# EasyEDA Pro project ProProject_AmaizeTrack.epro, board AmaizePCB
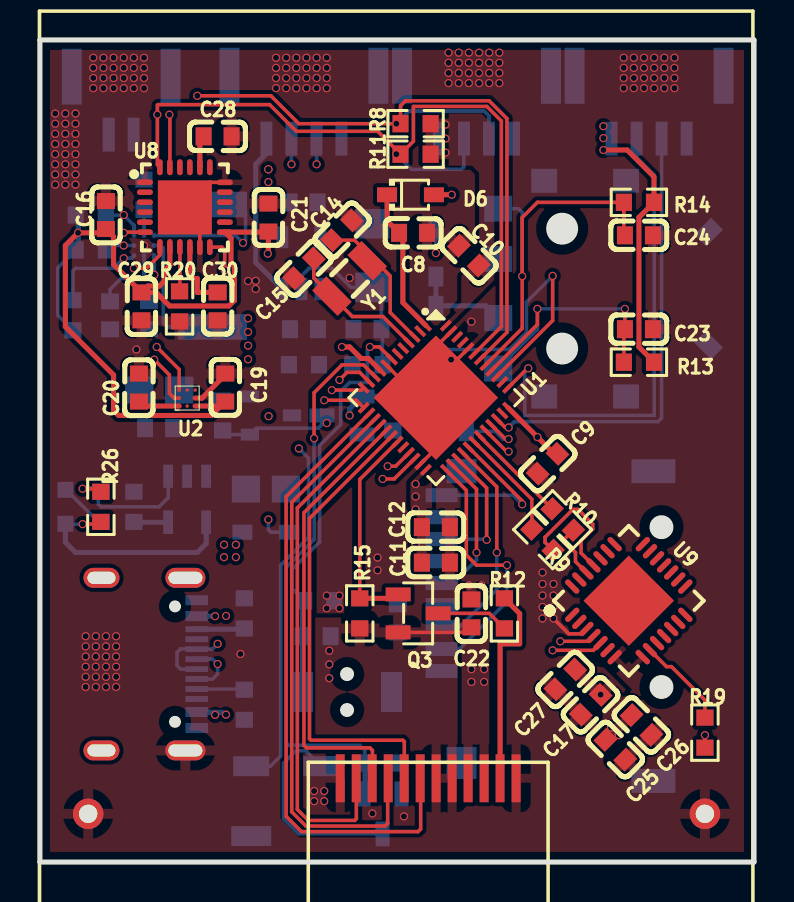
[diagram p2: board, top side]
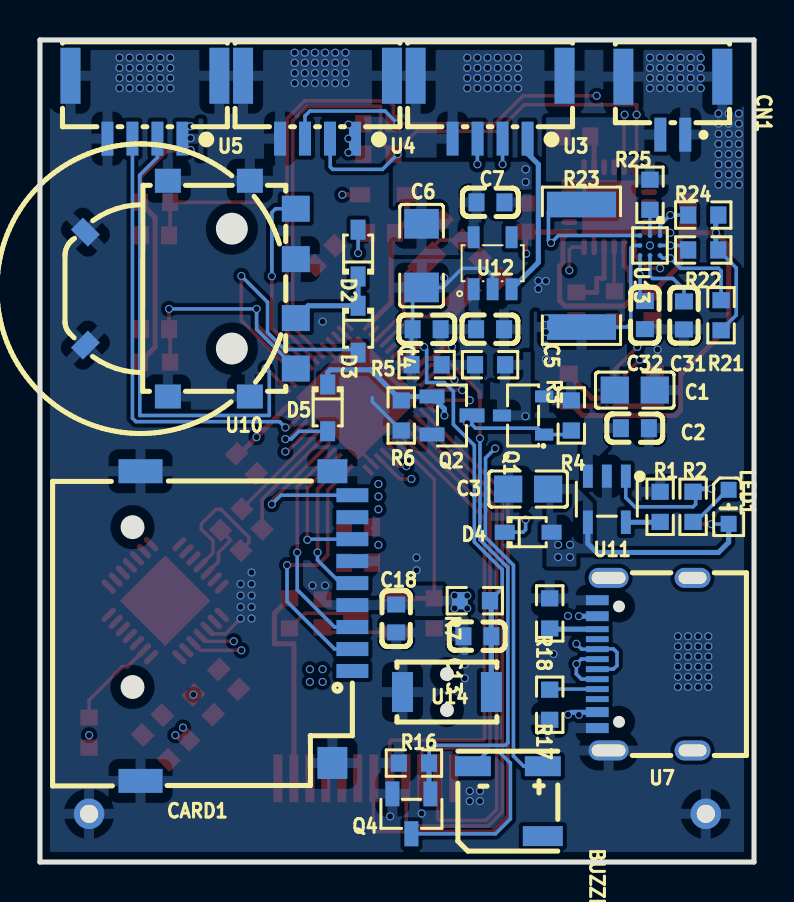
[diagram p3: board, bottom side, seen from below]

Outline 35.73 x 41.15 mm; copper layers: Top Layer, Inner1, Inner2, Bottom Layer. Coordinates in mm from the lower left corner of the outline.
Outline path: 0,41.15 35.73,41.15 35.73,0 0,0 0,41.15
Stack: Top Layer 0.035mm 外层铜厚1oz / Dielectric1 0.2104mm 7628 RC49% 8.6mil / Inner1 0.0152mm 内层铜厚 / Dielectric2 1.065mm 1.1mm H/HOZ 含铜 / Inner2 0.0152mm 内层铜厚 / Dielectric3 0.2104mm 7628 RC49% 8.6mil / Bottom Layer 0.035mm 外层铜厚1oz

## Design rules (mm)
template: 自定义配置
spacing copperThickness1oz (default): track to track 0.102, other pairs 0.152 to 0.3
spacing copperThickness2oz: track to track 0.203, other pairs 0.152 to 0.3
spacing copperThicknessInner0.5oz: track to track 0.089, other pairs 0.152 to 0.3
track width copperThickness1oz (default): min 0.102, default 0.254, max 2.54
track width copperThickness2oz: min 0.203, default 0.254, max 2.54
track width copperThickness0.5oz: min 0.089, default 0.254, max 2.54
differential pair differentialPair (default): width min 0.127, default 0.254, max 2.54; gap min 0.152, default 0.152
via viaSize (default): diameter min 0.3, default 0.61, max 10; hole min 0.201, default 0.305, max 6.299
net GND uses copperRegion1
net 3V3 uses copperRegion1
net BAT_IN uses copperRegion1
net BAT uses copperRegion1
net USB_VCC uses copperRegion1
net V33_CP2102 uses copperRegion1
net BAT_PACK+ uses copperRegion1

## Placement (name value [footprint] x y rotation side)
BUZZER1  4kHz  [BUZ-SMD_FST-5030]  12.32 3.05 0 bottom
C1  4.7uF  [C0805]  5.97 23.62 180 bottom
C2  100nF  [C0603]  5.96 21.72 180 bottom
C3  4.7uF  [C0805]  11.3 18.67 0 bottom
C4  100nF  [C0603]  16.38 26.67 0 bottom
C5  10uF  [C0603]  13.21 26.67 180 bottom
C6  22uF  [C1206]  16.64 30.35 270 bottom
C7  100nF  [C0603]  13.19 33.02 180 bottom
C8  100nF  [C0603]  18.67 31.5 180 top
C9  1uF  [C0603]  25.4 19.94 225 top
C10  1uF  [C0603]  21.46 30.35 135 top
C11  1uF  [C0603]  19.81 14.99 0 top
C12  1uF  [C0603]  19.81 16.76 0 top
C13  100nF  [C0603]  13.84 11.3 180 bottom
C14  22pF  [C0603]  15.11 31.62 225 top
C15  22pF  [C0603]  13.21 29.72 225 top
C16  1uF  [C0603]  3.3 32.39 270 top
C17  4.7uF  [C0603]  27.56 7.87 45 top
C18  100nF  [C0603]  17.91 12.19 90 bottom
C19  2.2uF  [C0603]  9.27 23.75 270 top
C20  4.7uF  [C0603]  4.95 23.75 90 top
C21  100nF  [C0603]  11.43 32.26 270 top
C22  100nF  [C0603]  21.59 12.45 90 top
C23  100nF  [C0603]  29.97 26.67 0 top
C24  100nF  [C0603]  29.97 31.37 0 top
C25  1uF  [C0603]  28.79 5.62 315 top
C26  100nF  [C0603]  30.1 6.86 315 top
C27  100nF  [C0603]  26.29 9.14 45 top
C28  2.2nF  [C0603]  8.89 36.32 0 top
C29  10nF  [C0603]  5.08 27.81 90 top
C30  100nF  [C0603]  8.89 27.81 270 top
C31  2.2uF  [C0603]  3.51 27.36 270 bottom
C32  1uF  [C0603]  5.46 27.38 90 bottom
CARD1  TF PUSH  [tf-smd_tf-push]  25.4 11.81 270 bottom
CN1  WAFER-GH1.25-2PWB  [CONN-TH_2P-P1.25_XUNPU_WAFER-GH1.25-2PWB]  4.06 37.86 0 bottom
D2  1N4148WS  [SOD-323_L1.8-W1.3-LS2.5-RD]  19.81 30.48 90 bottom
D3  1N4148WS  [SOD-323_L1.8-W1.3-LS2.5-RD]  19.81 26.67 270 bottom
D4  1N4148WS  [SOD-323_L1.8-W1.3-LS2.5-RD]  11.3 16.51 180 bottom
D5  1N4148WS  [SOD-323_L1.8-W1.3-LS2.5-RD]  21.34 22.73 270 bottom
D6  1N4007WS  [SOD-323_L1.8-W1.3-LS2.5-RD]  18.54 33.4 0 top
LCD1  SCREEN 2.0'  [SCREEN 2.0' 12PIN]  19.43 2.99 0 top
LED1  SZYY0603R  [LED0603-R-RD]  1.27 17.78 270 bottom
NOREF  -  [Pad_e649]  33.27 2.41 0 top
NOREF#2  -  [Pad_e650]  2.41 2.41 0 top
Q1  AO3401  [SOT-23-3_L2.9-W1.4-P1.90-LS2.6-BR]  11.56 22.35 180 bottom
Q2  AO3400  [SOT-23-3_L2.9-W1.3-P1.90-LS2.4-BR]  15.11 22.35 0 bottom
Q3  AO3400  [SOT-23-3_L2.9-W1.3-P1.90-LS2.4-BR]  18.92 12.45 180 top
Q4  AO3400  [SOT-23-3_L2.9-W1.3-P1.90-LS2.4-BR]  17.15 2.41 90 bottom
R1  2kΩ  [R0603]  4.7 17.78 90 bottom
R2  1kΩ  [R0603]  3.05 17.78 90 bottom
R3  20kΩ  [R0603]  13.21 24.89 0 bottom
R4  20kΩ  [R0603]  9.14 22.35 270 bottom
R5  20kΩ  [R0603]  16.38 24.89 0 bottom
R6  20kΩ  [R0603]  17.65 22.35 90 bottom
R7  10kΩ  [R0603]  13.97 13.08 180 bottom
R8  10kΩ  [R0603]  18.8 36.96 180 top
R9  100Ω  [R0603]  25.15 16.13 315 top
R10  100Ω  [R0603]  26.16 17.14 315 top
R11  10kΩ  [R0603]  18.8 35.43 180 top
R12  10Ω  [R0603]  23.24 12.45 270 top
R13  10kΩ  [R0603]  29.97 25.02 180 top
R14  10kΩ  [R0603]  29.97 33.02 180 top
R15  10kΩ  [R0603]  16 12.45 270 top
R16  10kΩ  [R0603]  17.02 4.95 0 bottom
R17  5.1kΩ  [R0603]  10.22 7.87 90 bottom
R18  5.1kΩ  [R0603]  10.22 12.45 270 bottom
R19  10kΩ  [R0603]  33.27 6.48 270 top
R20  10kΩ  [R0603]  6.99 27.81 90 top
R21  10kΩ  [R0603]  1.65 27.37 90 bottom
R22  10kΩ  [R0603]  2.54 30.64 0 bottom
R23  0Ω  [R2512]  8.64 29.84 270 bottom
R24  10kΩ  [R0603]  2.54 32.39 180 bottom
R25  SDNT1608X103F3380FTF  [R0603]  5.21 33.4 90 bottom
R26  10kΩ  [R0603]  3.05 17.78 90 top
U1  AT32F403ACGU7  [qfn-48_l6.0-w6.0-p0.40-bl-ep4.2]  19.81 23.24 225 top
U2  QMC6310U  [LGA-8_L1.2-W1.2-P0.40-R3-C3-TL]  7.37 23.22 180 top
U3  WAFER-GH1.25-4PWB  [CONN-SMD_4P-P1.25_XUNPU_WAFER-GH1.25-4PWB]  13.21 37.78 0 bottom
U4  WAFER-GH1.25-4PWB  [CONN-SMD_4P-P1.25_XUNPU_WAFER-GH1.25-4PWB]  21.84 37.78 0 bottom
U5  WAFER-GH1.25-4PWB  [CONN-SMD_4P-P1.25_XUNPU_WAFER-GH1.25-4PWB]  30.48 37.78 0 bottom
U7  USB-TYPE-C-019  [TYPE-C-SMD_HX-TYPE-C-16PIN]  5.46 9.91 90 bottom
U8  MPU-6050  [QFN-24_L4.0-W4.0-P0.50-BL-EP2.7]  7.25 32.78 270 top
U9  CP2102-GMR  [WQFN-28_L5.0-W5.0-P0.50-BL-EP3.2]  29.46 13.08 315 top
U10  SIQ-02FVS3  [SW-SMD_SIQ-02FVS3_1]  28.19 28.7 90 bottom
U11  MCP73831T-2ACI/OT  [SOT-23-5_L3.0-W1.7-P0.95-LS2.8-BL]  7.37 18.16 0 bottom
U12  LP5907MFX-3.3/NOPB  [SOT-23-5_L3.0-W1.7-P0.95-LS2.8-BR]  13.08 29.97 270 bottom
U13  BQ27220YZFR  [dsbga-9_l1.7-w1.6-r3-c3-p0.50-bl]  5.21 30.86 0 bottom
U14  ZX-QC34-2TPDZ  [KEY-SMD_L3.9-W3.0-LS5.0-EH]  15.37 8.51 180 bottom
Y1  32.768kHz  [FC-135R_L3.2-W1.5]  15.49 29.21 225 top

## Footprints (pads in the part's own frame, mm; a bottom-side part is the same pattern mirrored in y, then rotated)
BUZ-SMD_FST-5030
  rect 1.8x1 smd: 1(-1.75,-1.75) 2(1.75,-1.75)
  rect 2x1 smd: 3(-1.75,1.75)
C0603
  rect 0.8x0.9 smd: 1(-0.7,0) 2(0.7,0)
C0805
  rect 1.41x1.35 smd: 1(-1,0) 2(1,0)
C1206
  rect 1.485x1.728 smd: 1(-1.593,0) 2(1.593,0)
CONN-SMD_4P-P1.25_XUNPU_WAFER-GH1.25-4PWB
  rect 0.6x1.7 smd: 1(1.875,1.575) 2(0.625,1.575) 3(-0.625,1.575) 4(-1.875,1.575)
  rect 1x2.8 smd: 5(3.725,-1.575) 6(-3.725,-1.575)
CONN-TH_2P-P1.25_XUNPU_WAFER-GH1.25-2PWB
  rect 0.6x1.7 smd: 1(-0.625,1.45) 2(0.625,1.45)
  rect 1x2.8 smd: 3(-2.475,-1.45) 4(2.475,-1.45)
dsbga-9_l1.7-w1.6-r3-c3-p0.50-bl
  round 0.24 smd: A1(-0.5,-0.5) A2(-0.5,0) A3(-0.5,0.5) B1(0,-0.5) B2(0,0) B3(0,0.5) C1(0.5,-0.5) C2(0.5,0) C3(0.5,0.5)
FC-135R_L3.2-W1.5
  rect 1x1.8 smd: 1(-1.25,0) 2(1.25,0)
KEY-SMD_L3.9-W3.0-LS5.0-EH
  rect 1.05x2 smd: 1(-2.225,0) 2(2.225,0)
LED0603-R-RD
  rect 0.8x0.8 smd: 1(0.851,0) 2(-0.851,0)
LGA-8_L1.2-W1.2-P0.40-R3-C3-TL
  round 0.17 smd: A1(-0.4,0.4) A2(0,0.4) A3(0.4,0.4) B1(-0.4,0) B3(0.4,0) C1(-0.4,-0.4) C2(0,-0.4) C3(0.4,-0.4)
Pad_e649
  round 1.524 hole 0.914: 50(0,0)
Pad_e650
  round 1.524 hole 0.914: 51(0,0)
QFN-24_L4.0-W4.0-P0.50-BL-EP2.7
  oval 0.28x0.8 smd: 1(-1.25,-2) 2(-0.75,-2) 3(-0.25,-2) 4(0.25,-2) 5(0.75,-2) 6(1.25,-2) 13(1.25,2) 14(0.75,2) 15(0.25,2) 16(-0.25,2) 17(-0.75,2) 18(-1.242,2)
  oval 0.8x0.28 smd: 7(2,-1.25) 8(2,-0.75) 9(2,-0.25) 10(2,0.25) 11(2,0.75) 12(2,1.25) 19(-2,1.25) 20(-2,0.75) 21(-2,0.25) 22(-2,-0.25) 23(-2,-0.75) 24(-2,-1.25)
  rect 2.7x2.7 smd: 25(0.013,0)
qfn-48_l6.0-w6.0-p0.40-bl-ep4.2
  rect 0.2x0.665 smd: 1(-2.2,-2.908) 2(-1.8,-2.908) 3(-1.4,-2.907) 4(-1,-2.908) 5(-0.6,-2.908) 6(-0.2,-2.908) 7(0.2,-2.908) 8(0.6,-2.908) 9(1,-2.908) 10(1.4,-2.907) 11(1.8,-2.908) 12(2.2,-2.908) 25(2.2,2.908) 26(1.8,2.908) 27(1.4,2.907) 28(1,2.908) 29(0.6,2.908) 30(0.2,2.908) 31(-0.2,2.908) 32(-0.6,2.908) 33(-1,2.908) 34(-1.4,2.907) 35(-1.8,2.908) 36(-2.2,2.908)
  rect 0.665x0.2 smd: 13(2.908,-2.2) 14(2.908,-1.8) 15(2.907,-1.4) 16(2.908,-1) 17(2.908,-0.6) 18(2.908,-0.2) 19(2.908,0.2) 20(2.908,0.6) 21(2.908,1) 22(2.907,1.4) 23(2.908,1.8) 24(2.908,2.2) 37(-2.908,2.2) 38(-2.908,1.8) 39(-2.907,1.4) 40(-2.908,1) 41(-2.908,0.6) 42(-2.908,0.2) 43(-2.908,-0.2) 44(-2.908,-0.6) 45(-2.908,-1) 46(-2.907,-1.4) 47(-2.908,-1.8) 48(-2.908,-2.2)
  rect 4.4x4.4 smd: 49(0,0)
R0603
  rect 0.806x0.864 smd: 1(-0.753,0) 2(0.753,0)
R2512
  rect 1.282x3.456 smd: 1(-3.067,0) 2(3.067,0)
SCREEN 2.0' 12PIN
  rect 0.45x2.4 smd: 1(4.4,1.2) 2(3.6,1.2) 3(2.8,1.2) 4(2,1.2) 5(1.2,1.2) 6(0.4,1.2) 7(-0.4,1.2) 8(-1.2,1.2) 9(-2,1.2) 10(-2.8,1.2) 11(-3.6,1.2) 12(-4.4,1.2)
SOD-323_L1.8-W1.3-LS2.5-RD
  rect 1x0.75 smd: 1(-1.173,0) 2(1.173,0)
SOT-23-3_L2.9-W1.3-P1.90-LS2.4-BR
  rect 1.25x0.7 smd: 1(1,-0.95) 2(1,0.95) 3(-1,0)
SOT-23-3_L2.9-W1.4-P1.90-LS2.6-BR
  rect 0.91x0.6 smd: 1(1.055,-0.955) 2(1.055,0.955) 3(-1.055,0)
SOT-23-5_L3.0-W1.7-P0.95-LS2.8-BL
  rect 0.49x1.157 smd: 1(-0.95,-1.153) 2(0,-1.153) 3(0.95,-1.153)
  rect 0.49x1.175 smd: 4(0.95,1.153) 5(-0.95,1.153)
SOT-23-5_L3.0-W1.7-P0.95-LS2.8-BR
  rect 1.1x0.6 smd: 1(1.3,-0.95) 2(1.3,0) 3(1.3,0.95) 4(-1.3,0.95) 5(-1.3,-0.95)
SW-SMD_SIQ-02FVS3_1
  rect 1.2x1.3 smd: 1(5.4,-2.964) 2(5.4,1.136) 5(-5.4,1.136) 6(-5.4,-2.964)
  rect 0.85x1.2 smd rot 45: 3(2.829,5.264)
  rect 0.85x1.2 smd rot 135: 4(-2.829,5.264)
  rect 1.3x1.4 smd: A(-4,-5.264) B(4,-5.264) C(1.475,-5.264) S(-1.475,-5.264)
tf-smd_tf-push
  rect 0.7x1.6 smd: 1(2.25,5.3) 2(1.15,5.3) 3(0.05,5.3) 4(-1.05,5.3) 5(-2.15,5.3) 6(-3.25,5.3) 7(-4.35,5.3) 8(-5.45,5.3) 9(-6.55,5.3)
  rect 1.2x1.5 smd: 10(-7.75,4.3)
  rect 1.2x2.2 smd: 11(-7.75,-5.3) 12(7.75,-5.3)
  rect 1.6x1.5 smd: 13(6.85,4.3)
TYPE-C-SMD_HX-TYPE-C-16PIN
  oval 1x1.8 hole 0.6x1.4: 1(-4.32,-2.384) 1(4.32,-2.384)
  oval 1x2 hole 0.6x1.7: 1(-4.32,1.816) 1(4.32,1.816)
  rect 0.5x1.14 smd: A1(-3.2,2.384) A4(-2.4,2.384) A9(2.4,2.384) A12(3.2,2.384)
  rect 0.3x1.14 smd: A5(-1.25,2.383) A6(-0.25,2.383) A7(0.25,2.383) A8(1.25,2.384) B5(1.75,2.383) B6(0.75,2.383) B7(-0.75,2.383) B8(-1.75,2.384)
WQFN-28_L5.0-W5.0-P0.50-BL-EP3.2
  oval 0.28x0.9 smd: 1(-1.502,-2.5) 2(-1.001,-2.5) 3(-0.5,-2.5) 4(0,-2.5) 5(0.5,-2.5) 6(1,-2.5) 7(1.501,-2.5) 15(1.501,2.5) 16(1,2.5) 17(0.5,2.5) 18(0,2.5) 19(-0.5,2.5) 20(-1.001,2.5) 21(-1.502,2.5)
  oval 0.9x0.28 smd: 8(2.5,-1.502) 9(2.5,-1.001) 10(2.5,-0.5) 11(2.5,0) 12(2.5,0.5) 13(2.5,1) 14(2.5,1.501) 22(-2.5,1.501) 23(-2.5,1) 24(-2.5,0.5) 25(-2.5,0) 26(-2.5,-0.5) 27(-2.5,-1.001) 28(-2.5,-1.502)
  rect 3.2x3.2 smd: 29(0,0)

## Nets
As in the schematic, except:
GND: C1.2 C2.2 C3.2 C4.2 C5.2 C6.2 C7.2 C8.1 C9.2 C10.2 C11.2 C12.2 C13.1 C14.1 C15.2 C16.1 C17.1 C18.1 C19.1 C20.2 C21.1 C22.1 C23.2 C24.2 C25.2 C26.2 C27.1 C28.2 C29.1 C30.2 C31.2 C32.1 CARD1.6 CARD1.10 CARD1.11 CARD1.12 CARD1.13 CN1.1 CN1.3 CN1.4 LCD1.1 LCD1.5 LCD1.6 LCD1.12 NOREF.50 NOREF#2.51 Q2.2 Q3.2 Q4.2 R1.2 R5.2 R6.1 R15.2 R16.2 R17.1 R18.1 R20.1 R25.2 U1.8 U1.23 U1.35 U1.44 U1.47 U1.49 U2.B1 U3.1 U3.5 U3.6 U4.1 U4.5 U4.6 U5.1 U5.5 U5.6 U7.1 U7.A1 U7.A12 U8.1 U8.11 U8.18 U8.25 U9.3 U10.1 U10.2 U10.3 U10.4 U10.5 U10.6 U10.C U11.2 U12.2 U13.B2 U14.1

Pads without a net: BUZZER1 3; CARD1 1 8; U1 2 5 6 20 38 45 46; U2 A2 C1 C2; U7 A8 B8; U8 2 3 4 5 14 15 16 17 19 21 22; U9 1 2 10 11 12 13 14 15 16 17 18 19 20 21 22 23 24 27 28 29; U12 4

## Via types
v1: diameter 0.406, hole 0.299, Top Layer to Bottom Layer, 266 vias

## Routing (per net, layer and track width the routed paths; a pad name or vN(x,y) marks a point on that pad's centre or on a via; arc(x,y) is an arc through that point)
3V3: length 97.9
  Top Layer w0.254: U1.9 16.44,25.2 16.08,25.2 15.5,25.78 v1(15.11,25.78) ; 7.77,22.82 9.05,22.82 ; 9.05,22.82 8.57,22.35 3.94,22.35 3.68,22.61 3.68,24.38 1.27,26.8 1.27,30.86 v1(1.91,31.5) 3.11,31.5 C16.2 3.68,31.3 3.68,29.91 C29.2 ; 9.05,22.82 C19.2 ; C29.2 5.81,28.51 6.49,27.83 9.46,27.83 9.73,28.11 9.73,29.82 9.56,29.98 9.56,31.22 U8.13 11.4,31.53 C21.2 11.43,30.48 v1(11.4,30.45) ; C29.2 5.4,28.83 5.97,28.83 6.22,29.08 6.22,29.59 6.5,29.87 U8.8 ; U1.36 v1(24.9,21.27) 25.73,20.43 C9.1 ; v1(28.19,35.64) 29.38,35.64 30.73,34.3 R14.1 29.97,32.27 29.97,25.78 30.73,25.03 R13.1
  Inner1 w0.254: v1(11.4,30.45) 11.43,30.48 v1(11.43,34.04) ; v1(18.8,18.92) 22.55,18.92 v1(24.9,21.27) ; v1(20.29,36.91) 19.36,37.85 14.6,37.85 v1(11.43,34.67)
  Inner2 w0.254: v1(15.11,25.78) 15.11,24.77 15.75,24.13 15.75,23.88 14.54,22.67 14.54,22.54 14.99,22.1 v1(14.99,13.34)
  Bottom Layer w0.178: R21.1 0.89,27.38 0.89,29.74 R22.1
  Bottom Layer w0.254: 1.91,32.39 1.91,30.64
  vias: v1(14.35,13.34) v1(14.35,12.7) v1(14.99,12.7) v1(18.8,18.3) v1(18.8,17.65) v1(18.8,15.88) v1(20.29,36.21) v1(20.29,35.51) v1(21.46,13.84) v1(21.59,9.65) v1(21.59,9.02) v1(22.1,13.84) v1(22.22,9.65) v1(22.22,9.02) v1(28.19,36.83) v1(28.19,36.23)
GND: length 36.6
  Top Layer w0.178: v1(25.69,12.19) 26.47,11.42 27.1,11.42 U9.3 ; U8.18 8.51,34.02 U8.25 8,32.02 U8.11 ; 19.81,24.09 U1.49 ; 19.81,24.09 21.44,25.72 ; 19.81,24.09 19.81,25.79 U1.47 ; C22.1 21.34,11.5 Q3.2 ; U1.49 18.96,23.24 17.33,24.87 ; U1.49 19.81,20.7 U1.23
  Top Layer w0.254: C19.1 9.27,24.38 8.11,23.22 7.77,23.22
  Bottom Layer w0.178: R6.1 19.1,23.05 19.1,23.24 ; R5.2 17.14,26.62 17.08,26.67 17.08,28.31 C6.2 15.56,28.76 14.6,29.72 13.46,29.72 13.08,29.34 U12.2
  vias: v1(0.76,37.47) v1(0.76,36.96) v1(0.76,36.45) v1(0.76,35.94) v1(0.76,35.43) v1(0.76,34.92) v1(0.76,34.42) v1(0.76,33.91) v1(1.27,37.47) v1(1.27,36.96) v1(1.27,36.45) v1(1.27,35.94) v1(1.27,35.43) v1(1.27,34.92) v1(1.27,34.42) v1(1.27,33.91) v1(1.78,37.47) v1(1.78,36.96) v1(1.78,36.45) v1(1.78,35.94) v1(1.78,35.43) v1(1.78,34.92) v1(1.78,34.42) v1(1.78,33.91) v1(2.29,11.3) v1(2.29,10.8) v1(2.29,10.29) v1(2.29,9.78) v1(2.29,9.27) v1(2.29,8.76) v1(2.67,40.26) v1(2.67,39.75) v1(2.67,39.24) v1(2.67,38.73) v1(2.79,11.3) v1(2.79,10.8) v1(2.79,10.29) v1(2.79,9.78) v1(2.79,9.27) v1(2.79,8.76) v1(3.18,40.26) v1(3.18,39.75) v1(3.18,39.24) v1(3.18,38.73) v1(3.3,11.3) v1(3.3,10.8) v1(3.3,10.29) v1(3.3,9.78) v1(3.3,9.27) v1(3.3,8.76) v1(3.68,40.26) v1(3.68,39.75) v1(3.68,39.24) v1(3.68,38.73) v1(3.81,11.3) v1(3.81,10.8) v1(3.81,10.29) v1(3.81,9.78) v1(3.81,9.27) v1(3.81,8.76) v1(4.19,40.26) v1(4.19,39.75) v1(4.19,39.24) v1(4.19,38.73) v1(4.7,40.26) v1(4.7,39.75) v1(4.7,39.24) v1(4.7,38.73) v1(4.83,25.65) v1(5.21,40.26) v1(5.21,39.75) v1(5.21,39.24) v1(5.21,38.73) v1(5.21,30.86) v1(10.03,10.41) v1(10.41,29.08) v1(10.8,29.09) v1(10.8,28.69) v1(11.81,40.26) v1(11.81,39.75) v1(11.81,39.24) v1(11.81,38.73) v1(12.32,40.26) v1(12.32,39.75) v1(12.32,39.24) v1(12.32,38.73) v1(12.83,40.26) v1(12.83,39.75) v1(12.83,39.24) v1(12.83,38.73) v1(13.34,40.26) v1(13.34,39.75) v1(13.34,39.24) v1(13.34,38.73) v1(13.72,3.56) v1(13.72,3.05) v1(13.84,40.26) v1(13.84,39.75) v1(13.84,39.24) v1(13.84,38.73) v1(14.22,3.56) v1(14.22,3.05) v1(14.35,40.26) v1(14.35,39.75) v1(14.35,39.24) v1(14.35,38.73) v1(14.48,10.58) v1(14.48,9.89) v1(14.48,9.2) v1(15.49,29.24) v1(16.63,2.43) v1(16.89,15.24) v1(16.89,14.61) v1(18.21,2.29) v1(20.45,40.51) v1(20.45,40) v1(20.45,39.5) v1(20.45,38.99) v1(20.57,25.15) v1(20.96,40.51) v1(20.96,40) v1(20.96,39.5) v1(20.96,38.99) v1(21.46,40.51) v1(21.46,40) v1(21.46,39.5) v1(21.46,38.99) v1(21.59,27.05) v1(21.97,40.51) v1(21.97,40) v1(21.97,39.5) v1(21.97,38.99) v1(22.48,40.51) v1(22.48,40) v1(22.48,39.5) v1(22.48,38.99) v1(22.99,40.51) v1(22.99,40) v1(22.99,39.5) v1(22.99,38.99) v1(25.15,14.49) v1(25.15,13.92) v1(25.15,13.34) v1(25.15,12.77) v1(25.15,12.19) v1(25.69,13.92) v1(25.69,13.34) v1(25.69,12.77) v1(29.21,40.26) v1(29.21,39.75) v1(29.21,39.24) v1(29.21,38.73) v1(29.72,40.26) v1(29.72,39.75) v1(29.72,39.24) v1(29.72,38.73) v1(30.23,40.26) v1(30.23,39.75) v1(30.23,39.24) v1(30.23,38.73) v1(30.73,40.26) v1(30.73,39.75) v1(30.73,39.24) v1(30.73,38.73) v1(31.24,40.26) v1(31.24,39.75) v1(31.24,39.24) v1(31.24,38.73) v1(31.75,40.26) v1(31.75,39.75) v1(31.75,39.24) v1(31.75,38.73)
V33_CP2102: length 7.4
  Top Layer w0.178: v1(33.27,6.35) R19.2
  Inner2 w0.178: v1(28.05,8.38) 30.08,8.38 30.69,7.77 33.12,7.77 33.27,7.62 v1(33.27,6.35)
VBAT: length 7.4
  Top Layer w0.254: U1.1 18.16,28 18.16,31.3 C8.2 17.37,32.1 D6.1
VDD_GAUGE: length 3.6
  Bottom Layer w0.178: C31.1 3.51,28.66 4.06,29.21 5.08,29.21 5.21,29.34 U13.B3
AUX_CL: length 11.3
  Top Layer w0.178: U8.7 6,30.39 5.33,29.72 v1(4.7,29.72) ; U2.B3 6.71,23.22 6.48,23.46 6.48,24.38 v1(5.72,25.15)
  Inner1 w0.178: v1(5.72,25.15) 6.48,25.15 6.6,25.27 6.6,25.65 4.06,28.19 4.06,29.08 v1(4.7,29.72)
AUX_DA: length 10.5
  Top Layer w0.178: v1(4.19,31.5) 4.22,31.53 U8.6 ; v1(5.84,25.78) 6.97,24.66 U2.C3
  Inner1 w0.178: v1(5.84,25.78) 3.68,27.94 3.68,30.99 v1(4.19,31.5)
BAT: length 28.4
  Inner1 w0.178: v1(11.44,22.32) 12.95,20.8 v1(12.95,20.7)
  Bottom Layer w0.178: BUZZER1.1 11.53,4.8 12.04,5.31 12.04,14.86 13.44,16.25 13.44,20.22 v1(12.95,20.7)
  Bottom Layer w0.254: U3.4 11.33,35.46 10.8,34.92 10.8,30.01 U12.3
BAT_CHG_DET: length 32.7
  Top Layer w0.178: 23.49,20.54 23.36,20.54 U1.32 ; v1(2.13,18.69) 2.9,18.69 R26.2
  Inner1 w0.178: v1(23.45,20.54) 22.38,19.47 18.57,19.47 15.7,16.6 4.22,16.6 v1(2.13,18.69)
  Bottom Layer w0.178: 2.92,18.53 2.92,17.91 3.05,17.78 5.96,17.78 6.42,18.23 U11.1
  Bottom Layer w0.254: v1(2.13,18.69) 2.77,18.69 2.92,18.53
BAT_DET: length 1.9
  Top Layer w0.178: v1(14.99,24.13) 15.37,24.51 16,24.51 U1.11
BAT_IN: length 24.3
  Top Layer w0.254: D6.2 v1(20.6,33.4)
  Inner2 w0.178: v1(10.41,27.22) 20.23,27.22 20.57,27.56 20.57,33.37 v1(20.6,33.4)
  Bottom Layer w0.178: R23.2 6.37,26.78 6.17,26.98 6.17,30.73 6.04,30.86 U13.C2
  Bottom Layer w0.254: C1.1 6.66,23.31
  vias: v1(10.41,26.53) v1(10.41,25.85) v1(10.41,25.17)
BAT_PACK+: length 15.5
  Inner1 w0.178: v1(10.16,30.99) 9.4,30.99 7.8,29.39 v1(5.73,29.39)
  Bottom Layer w0.178: R23.1 9.89,32.91 10.29,32.51 10.29,31.11 v1(10.16,30.99) 9.79,31.36 U13.C1 ; U13.C3 5.71,28.32 C32.2
BUZZ: length 28.3
  Top Layer w0.178: v1(13.72,21.21) 13.72,23.49 15.11,24.88 16.19,24.88 16.77,24.31
  Bottom Layer w0.178: v1(13.72,21.21) 13.72,16.14 12.32,14.74 12.32,5.97 12.45,5.84 16,5.84 16.26,5.59 16.26,4.96 R16.1
  Bottom Layer w0.254: R16.1 16.26,3.48 Q4.1
D+: length 26.5
  Top Layer w0.178: U9.4 27.43,11.05 v1(26.03,11.05)
  Inner1 w0.178: v1(26.03,11.05) 25.15,11.05 20.7,6.6 15.24,6.6 10.92,10.92 v1(8.89,10.92)
  Bottom Layer w0.178: v1(8.89,10.92) 8.62,10.66 U7.B6 7.83,10.67 7.04,10.67 6.86,10.49 6.86,9.83 7.04,9.66 U7.A6
D-: length 25.4
  Top Layer w0.178: v1(25.65,10.6) 27.69,10.6 28.05,10.96
  Inner1 w0.178: v1(8.89,9.91) 11.54,9.91 15.12,6.32 20.93,6.32 25.2,10.6 v1(25.65,10.6)
  Bottom Layer w0.178: U7.A7 7.85,10.16 8.64,10.16 v1(8.89,9.91) 8.89,9.41 8.64,9.16 U7.B7
EC_A: length 14.9
  Top Layer w0.178: v1(24.89,27.69) 24.89,26.91 U1.40 ; 29.27,27.69 C23.1 29.22,26.62 R13.2
  Bottom Layer w0.178: U10.A 24.89,26.66 v1(24.89,27.69) v1(29.27,27.69)
EC_B: length 19.7
  Top Layer w0.178: C24.1 29.22,31.42 R14.2 24.89,33.02 24.13,32.26 v1(24.13,29.32) 24.13,26.71 U1.41
  Bottom Layer w0.178: v1(24.13,29.32) 24.13,32.51 23.94,32.7 U10.B
EC_KEY: length 4.8
  Bottom Layer w0.254: U10.S 22.31,27.84 D3.1 D2.1
EC_KEY_DET: length 14.5
  Top Layer w0.178: v1(25.65,29.34) 25.65,27.1 22.86,24.31
  Bottom Layer w0.178: v1(25.65,29.34) 24.35,28.03 24.35,26.51 23.49,25.65 19.97,25.65 D3.2
GAUGE_INT: length 27.4
  Top Layer w0.178: v1(17.15,19.18) 17.73,19.18 18.75,20.2
  Inner1 w0.178: v1(17.15,19.18) 10.29,19.18 3.3,26.16 3.3,31.24 4.19,32.12 v1(4.19,32.39)
  Bottom Layer w0.178: U13.A1 4.71,31.87 4.2,32.38 4.2,32.39 3.42,32.39
GPS_RX: length 15.6
  Top Layer w0.178: U1.12 16.08,23.62 v1(14.6,23.62)
  Inner1 w0.178: v1(13.84,34.92) 13.21,34.92 13.08,34.8 13.08,25.15 v1(14.6,23.62)
  Bottom Layer w0.178: v1(13.84,34.92) 13.84,36.2 U3.2
GPS_TX: length 15.9
  Top Layer w0.178: U1.13 15.83,23.11 v1(14.22,23.11)
  Inner1 w0.178: v1(14.22,23.11) 12.58,24.75 v1(12.58,34.92)
  Bottom Layer w0.178: U3.3 12.58,34.93
IMU_INT1: length 17.8
  Top Layer w0.178: v1(17.4,19.81) 17.8,19.81 U1.21 ; U8.12 9.1,30.78 9.25,30.63 v1(9.25,29.62)
  Inner1 w0.178: v1(17.4,19.81) 15.14,22.07 14.55,21.49 14.07,21.49 11.05,24.51 11.05,27.56 9.27,29.34 9.27,29.59 v1(9.25,29.62)
MCU_RX: length 5.2
  Top Layer w0.178: 25.76,17.8 25.5,17.8 22.01,21.3 U1.31
MCU_SCL: length 54.2
  Top Layer w0.178: U1.42 23.37,26.51 23.37,37.21 22.48,38.1 18.29,38.1 18.04,37.85 R8.2 v1(17.83,36.96) 12.95,36.96 11.56,38.35 v1(7.87,38.35) ; U8.23 6.5,37.38 v1(6.48,37.41)
  Inner1 w0.178: 4.32,30.23 5.33,30.23 6.48,31.37 v1(6.48,37.41) 7.42,38.35 v1(7.87,38.35)
  Bottom Layer w0.178: U13.A3 4.57,30.23 v1(4.19,30.23) 3.68,29.72 1.78,29.72 1.65,29.59 R21.2 ; v1(17.83,36.96) 18.47,37.59 22.22,37.59 22.48,37.34 22.47,37.33 U4.2
MCU_SDA: length 49.7
  Top Layer w0.178: U8.24 5.88,34.91 v1(5.88,37.41) 5.88,37.88 5.91,37.91 11.49,37.91 12.83,36.58 16.9,36.58 R11.2 18.69,36.08 18.69,37.82 22.36,37.82 23.09,37.1 23.09,26.8 U1.43
  Inner1 w0.178: 4.18,30.86 5.88,32.55 v1(5.88,37.41)
  Bottom Layer w0.178: 3.42,30.64 3.65,30.86 U13.A2 ; U4.3 21.21,36.2 21.21,34.8 21.08,34.67 18.59,34.67 v1(17.83,35.43)
  vias: v1(4.19,30.86)
MCU_TX: length 5.6
  Top Layer w0.178: U1.30 24.61,18.16 R9.1
OSC32_IN: length 7.2
  Top Layer w0.178: 14.62,31.13 15.74,31.13 17.53,29.34 17.53,27.51 18.75,26.29
OSC32_OUT: length 7.1
  Top Layer w0.178: C15.1 13.7,29.23 15.63,27.31 17.16,27.31 U1.4
PWR_EN: length 3.5
  Top Layer w0.178: v1(23.45,21.17) 23.3,21.17 U1.33
  Bottom Layer w0.178: v1(23.45,21.17) 23.16,21.17 22.77,21.56 D5.2
RST: length 21.2
  Top Layer w0.178: U1.7 16.99,25.78 v1(16.51,25.78)
  Bottom Layer w0.178: R7.2 12.6,13.7 12.6,14.63 14,16.02 14,20.85 15.04,21.9 15.04,23.55 15.49,24 16.38,24 16.38,25.65 v1(16.51,25.78)
  Bottom Layer w0.254: R7.2 13.14,13.01 13.14,11.43 13.27,11.3 13.14,11.17 U14.2
SCR_BLK: length 10.6
  Top Layer w0.178: U1.19 16,19.15 R15.1
  Top Layer w0.254: Q3.1 17.73,13.2 R15.1
SCR_CS: length 23.7
  Top Layer w0.178: 18.23,3.99 18.23,6.03 18.16,6.1 13.56,6.1 13.49,6.17 13.49,17.2 U1.18
SCR_DC: length 31.3
  Top Layer w0.178: U1.14 12.32,18.29 12.32,2.29 13.08,1.52 18.92,1.52 19.05,1.65 19.05,3.97 19.03,3.99
SCR_LEDK: length 10.3
  Top Layer w0.254: R12.1 24,12.44 24,10.92 23.03,10.92 LCD1.2
SCR_RES: length 26
  Top Layer w0.178: 15.83,3.99 15.83,2.17 15.75,2.08 13.43,2.08 12.88,2.63 12.88,17.72 U1.16
SCR_SCL: length 28.6
  Top Layer w0.178: 17.43,3.99 17.4,3.96 17.4,1.93 17.27,1.8 13.31,1.8 12.6,2.51 12.6,18.01 16.77,22.17
SCR_SDA: length 22.6
  Top Layer w0.178: 17.33,21.61 13.21,17.49 13.21,5.84 13.34,5.72 16.51,5.72 16.64,5.59 16.64,4 16.63,3.99
SD_CD: length 8.2
  Top Layer w0.178: v1(24.13,17.91) 24.13,18.07 U1.29
  Bottom Layer w0.178: v1(24.13,17.91) 23.68,18.36 CARD1.9
SD_CS: length 13
  Top Layer w0.178: U1.25 21.34,18.61 21.34,15.37 21.84,14.86 v1(23.37,14.86)
  Bottom Layer w0.178: v1(23.37,14.86) 23.37,13.04 20.99,10.66 CARD1.2
SD_MISO: length 6.9
  Top Layer w0.178: U1.27 22.35,18.72 v1(22.35,16.13)
  Bottom Layer w0.178: v1(22.35,16.13) 22.32,16.16 CARD1.7
SD_MOSI: length 11.1
  Top Layer w0.178: U1.28 22.86,18.78 v1(22.86,15.49)
  Bottom Layer w0.178: 20.1,11.76 20.99,11.76 22.86,13.63 v1(22.86,15.49)
SD_SCK: length 7.5
  Top Layer w0.178: U1.26 21.84,18.66 v1(21.84,15.49)
  Bottom Layer w0.178: v1(21.84,15.49) 21.84,15.11 20.69,13.96 20.1,13.96
SWCLK: length 24.6
  Top Layer w0.178: 24.51,24.77 24.45,24.77 U1.37
  Bottom Layer w0.178: v1(24.44,24.71) 24.26,24.54 24.26,22.35 30.73,22.35 30.73,34.39 29.85,35.27 U5.3
SWDIO: length 22.6
  Top Layer w0.178: v1(23.45,21.75) 23.28,21.75 U1.34
  Bottom Layer w0.178: U5.2 31.1,22.22 30.93,22.04 23.74,22.04 v1(23.45,21.75)
USB_VCC: length 34.7
  Top Layer w0.178: R26.1 2.94,16.92 v1(2.13,16.92)
  Inner2 w0.178: v1(28.96,6.35) 27.69,5.08 11.7,5.08 9.27,7.51
  Bottom Layer w0.178: v1(2.13,16.92) 1.28,16.92 LED1.1
  Bottom Layer w0.254: v1(8.76,12.31) U7.A9 ; 9.14,7.49 7.86,7.49 U7.A4 ; U11.4 8.32,15.94 7.87,15.49 1.78,15.49 1.27,16 LED1.1
  vias: v1(8.76,7.37) v1(9.21,15.88) v1(9.21,15.26) v1(9.31,12.32) v1(9.31,7.38) v1(9.8,15.88) v1(9.8,15.26) v1(28.57,6.73)
$1N4620: length 2.1
  Top Layer w0.254: 6.97,22.82 5.18,22.82 C20.1
$1N6394: length 3.6
  Top Layer w0.178: R12.2 22.49,12.45 Q3.3
$1N8215: length 1.6
  Top Layer w0.254: U8.20 8,36.13 8.19,36.32
$1N9459: length 4.7
  Top Layer w0.178: 30.52,10.61 31.35,9.78 31.6,9.78 33.27,8.11 R19.1
$1N9734: length 3
  Top Layer w0.178: 26.82,16.74 26.19,16.1 26.8,15.49 26.8,15.04 27.34,14.5
$1N9736: length 6.7
  Top Layer w0.178: U9.25 27.08,15.47 27.08,16.08 27.66,16.67 27.66,16.92 26.92,17.65 26.67,17.65 25.27,16.26 25.27,16 R9.2
$1N17722: length 3.6
  Top Layer w0.254: U8.10 7.5,29.25 7.53,29.25 7.57,29.21 7.87,29.21 7.87,28.51 C30.1
$1N17759: length 2.3
  Top Layer w0.178: U8.9 7,28.68 7.11,28.57
$2N665: length 18.2
  Inner1 w0.178: v1(14.35,21.97) 14.44,21.97 19.81,27.34 v1(19.81,30.48)
  Bottom Layer w0.178: v1(14.35,21.97) 14.35,22.11 Q2.3 14.11,21.89 13.94,21.72 10.82,21.72 Q1.1 9.47,21.4 9.14,21.73 ; D2.2 v1(19.81,30.48)
$2N875: length 21.1
  Inner1 w0.178: v1(11.43,17.14) 11.7,16.88 15.58,16.88 17.84,19.14 17.84,20 15.49,22.35 v1(15.49,22.35)
  Bottom Layer w0.178: v1(11.43,17.14) 11.43,16.64 11.56,16.51 D4.1
  Bottom Layer w0.254: D5.1 21.34,24.51 21.21,24.64 19.19,24.64 R6.2 17.46,23.3 Q2.1 15.49,22.68 v1(15.49,22.35)
$2N1939: length 2.3
  Bottom Layer w0.178: 2.92,17.03 1.32,18.63 LED1.2
$2N1957: length 1.9
  Bottom Layer w0.254: 4.57,17.03 4.59,17.01 U11.5
$2N3420: length 1.3
  Bottom Layer w0.178: R25.1 U13.B1
$2N9095: length 2.1
  Bottom Layer w0.178: 9.97,8.66 U7.A5
$2N9100: length 2.1
  Bottom Layer w0.254: 9.97,11.66 U7.B5
$2N16866: length 10.5
  Bottom Layer w0.178: Q4.3 12.94,1.41 12.19,2.16 12.19,4.95 12.8,5.56 13.3,5.56 BUZZER1.2

## Copper pours and planes (outline as drawn; the poured copper is in the pictures)
3V3 on Top Layer: 22.48,5.08 21.1,5.08 21.1,14.39 22.48,14.39
3V3 on Top Layer: 15.27,12.45 13.84,12.45 13.84,17.04 15.62,18.82 15.62,13.72 15.23,13.72 15.23,12.48
3V3 on Top Layer: 20.15,26.55 22.73,29.13 22.73,36.83 22.1,37.47 19.18,37.47 19.05,37.34 19.05,34.85 21.62,34.85 21.97,34.5 21.97,30.61 21.08,29.72 21.08,28.02 19.88,26.81
3V3 on Top Layer: 19.48,19.94 19.62,19.79 19.62,14.39 18.53,14.39 18.53,19.02 18.56,19.02
3V3 on Bottom Layer: 27.56,37.21 29.21,37.21 29.21,35.18 27.56,35.18
3V3 on Bottom Layer: 11.05,33.66 11.05,34.8 11.3,35.05 18.07,35.05 18.07,30.39 13.19,30.39 13.19,33.41 12.95,33.66
3V3 on Bottom Layer: 19.18,37.21 20.7,37.21 20.7,35.05 19.18,35.05
3V3 on Bottom Layer: 14.22,12.32 21.06,12.32 22.61,13.87 22.61,15.11 22.24,15.11 21.08,13.95 21.08,13.46 19.2,13.46 19.2,13.84 14.22,13.84
3V3 on Inner2: 19.48,19.02 18.53,19.02 18.53,14.39 18.16,14.02 14.07,14.02 14.07,12.48 14.22,12.32 19.05,12.32 21.08,10.29 21.08,5.76 22.53,5.76 22.53,8.64 33.27,8.64 33.27,37.47 19.18,37.47 19.05,37.34 19.05,34.95 19.18,34.82 21.57,34.82 21.97,34.42 30.34,34.42 30.61,34.15 30.61,14.61 32,13.21 29.43,10.63 22.91,10.63 22.91,15.97 20.21,15.97 19.48,16.69
GND on Top Layer: 0,41.15 35.73,41.15 35.73,0 0,0
GND on Bottom Layer: 0,41.15 35.73,41.15 35.73,0 0,0
GND on Inner1: 0,41.15 35.73,41.15 35.73,0 0,0
GND on Inner2: 0,41.15 35.73,41.15 35.73,0 0,0
V33_CP2102 on Top Layer: 27.74,10.27 26.66,10.28 26.03,9.65 28.2,7.49 29.33,8.62 28.06,9.9 28.06,9.95 28.83,10.79 28.55,11.08
BAT on Bottom Layer: 13.21,22.1 11.18,22.1 11.18,25.53 12.57,25.53 13.22,26.22 13.22,27.42 12.95,27.69 11.94,27.69 11.7,27.92 11.7,29.36 12.59,29.36 12.59,27.98 13.55,27.98 13.55,29.36 14.45,29.36 14.45,27.31 16.14,27.31 16.19,27.26 16.19,25.62 13.64,25.62 13.21,25.15
BAT_DET on Bottom Layer: 16,25.44 13.54,25.44 13.54,23.18 13.87,23.18 13.87,23.62 14.37,24.13 15.19,24.13 15.58,24.51 15.88,24.51 16,24.63
BAT_IN on Bottom Layer: 8.64,18.67 8.64,20.83 8.51,20.95 8.51,22.22 11.02,22.22 11.02,27.56 6.36,27.56 6.36,21.17 6.89,21.17 8,20.07 8,18.67
BAT_PACK+ on Bottom Layer: 10.41,32.26 6.86,32.26 6.86,35.56 4.32,35.56 4.32,37.28 10.41,37.28 10.41,32.26
USB_VCC on Top Layer: 27.43,6.22 28.32,5.33 30.81,7.82 31.29,9.35 29.95,10.69 29.63,10.38 29.12,10.88 28.25,10.01 29.63,8.63 27.43,6.24
USB_VCC on Bottom Layer: 11.05,19.43 9.53,19.43 8,17.91 8,15.45 8.89,15.45 8.89,14.79 10.39,14.79 10.39,18.05 11.05,18.05
USB_VCC on Inner2: 8.88,16.13 10.8,16.13 10.8,11.3 8.73,11.3 8.73,8.13 10.6,8.13 10.6,6.88 7.24,6.88 7.24,13.51 8.88,13.51
